# EAGLE design untitled (EAGLE 8.5.0)
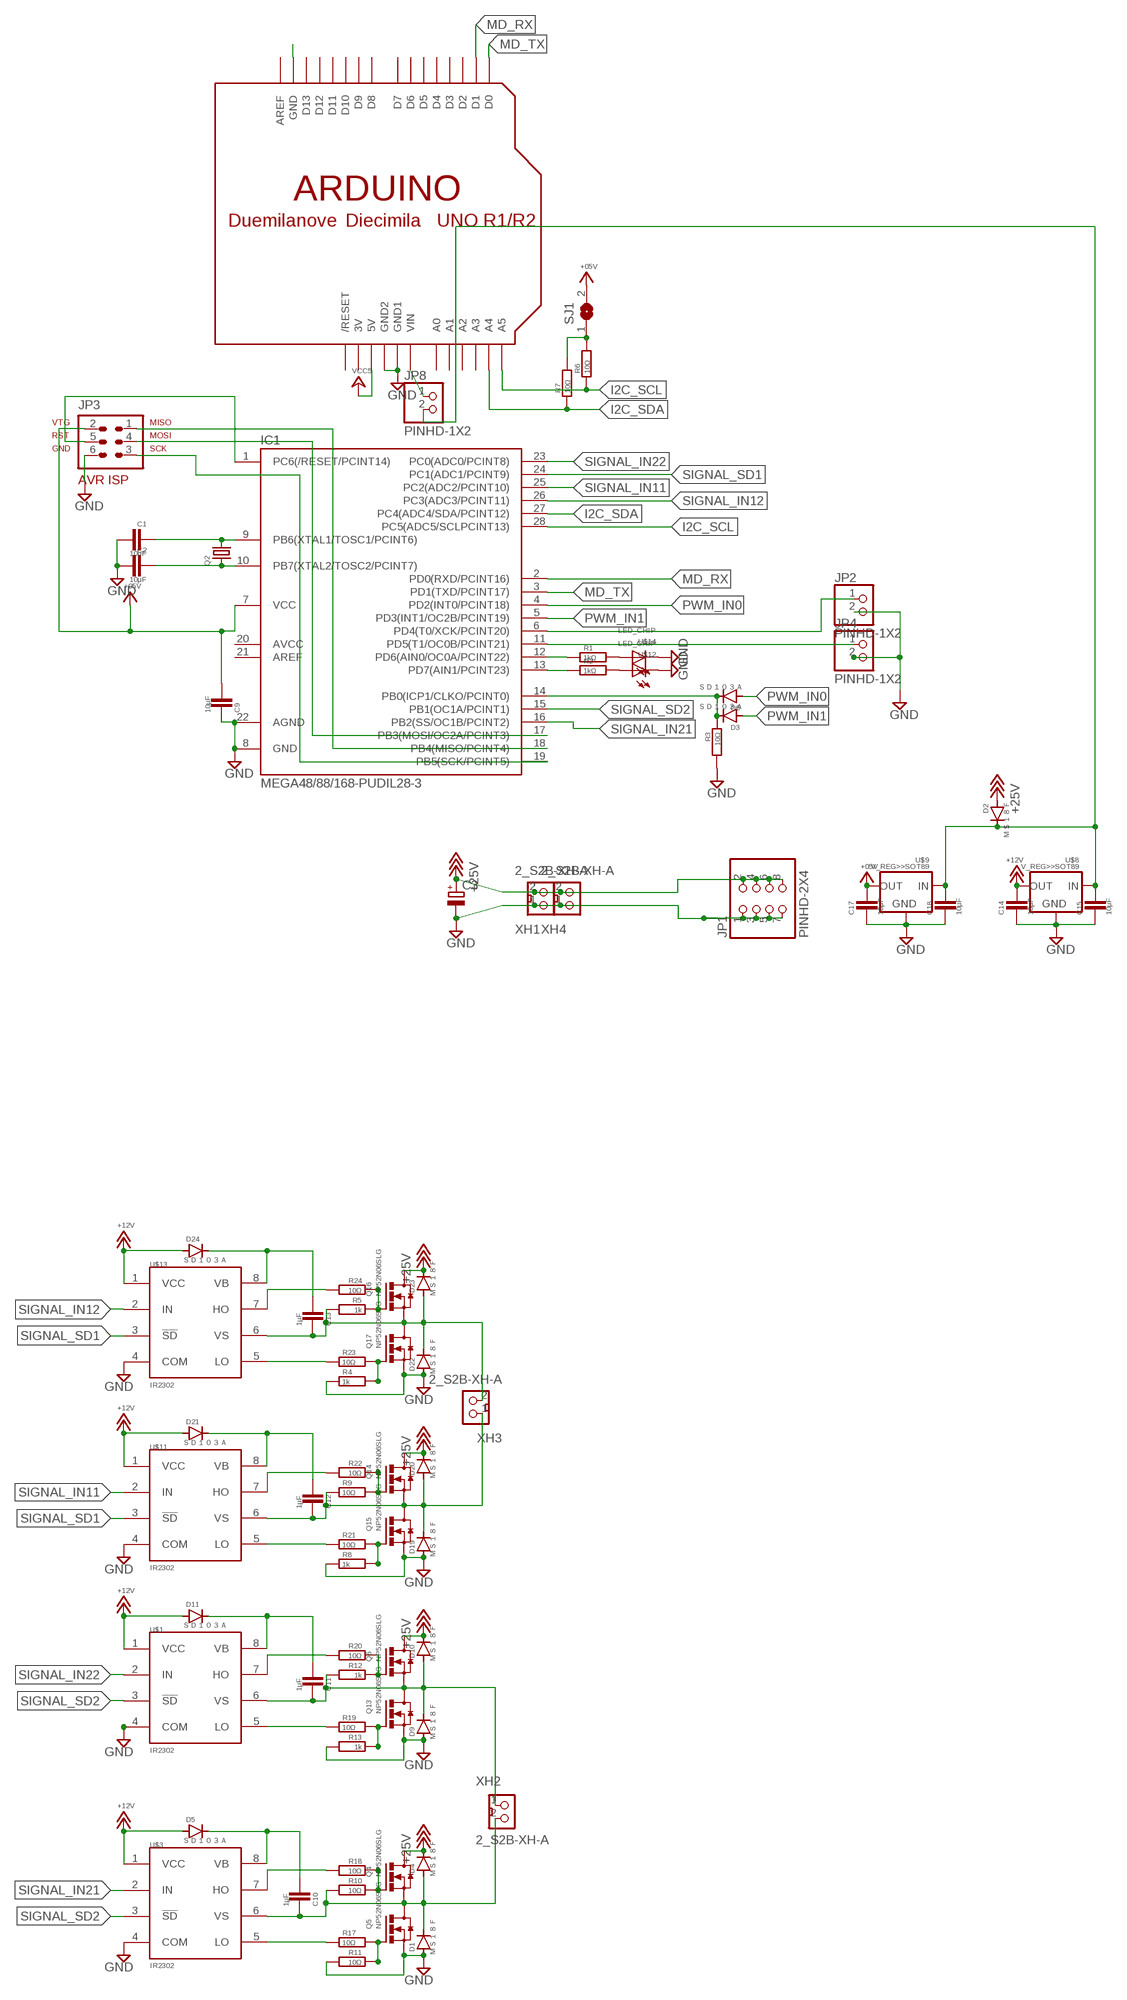
[diagram p0: schematic, sheet 1]

## Parts
C1  10μF  CAPACITOR>>2012  [2012]
C2  10μF  CAPACITOR>>2012  [2012]
C3  CPOL-EUUD-6,3X8,8  [UD-6,3X5,8_NICHICON]
C9  10μF  CAPACITOR>>2012  [2012]
C10  1μF  CAPACITOR>>2012  [2012]
C11  1μF  CAPACITOR>>2012  [2012]
C12  1μF  CAPACITOR>>2012  [2012]
C13  1μF  CAPACITOR>>2012  [2012]
C14  10μF  CAPACITOR>>2012  [2012]
C15  10μF  CAPACITOR>>2012  [2012]
C17  10μF  CAPACITOR>>2012  [2012]
C18  10μF  CAPACITOR>>2012  [2012]
D1  ＭＳ１８Ｆ  DIODE>>MS18F  [MS18F]
D2  ＭＳ１８Ｆ  DIODE>>MS18F  [MS18F]
D3  ＳＤ１０３Ａ  DIODE>>SOD123  [SOD123]
D4  ＭＳ１８Ｆ  DIODE>>MS18F  [MS18F]
D5  ＳＤ１０３Ａ  DIODE>>SOD123  [SOD123]
D6  ＳＤ１０３Ａ  DIODE>>SOD123  [SOD123]
D9  ＭＳ１８Ｆ  DIODE>>MS18F  [MS18F]
D10  ＭＳ１８Ｆ  DIODE>>MS18F  [MS18F]
D11  ＳＤ１０３Ａ  DIODE>>SOD123  [SOD123]
D19  ＭＳ１８Ｆ  DIODE>>MS18F  [MS18F]
D20  ＭＳ１８Ｆ  DIODE>>MS18F  [MS18F]
D21  ＳＤ１０３Ａ  DIODE>>SOD123  [SOD123]
D22  ＭＳ１８Ｆ  DIODE>>MS18F  [MS18F]
D23  ＭＳ１８Ｆ  DIODE>>MS18F  [MS18F]
D24  ＳＤ１０３Ａ  DIODE>>SOD123  [SOD123]
IC1  MEGA48/88/168-PUDIL28-3  [DIL28-3]
JP1  PINHD-2X4  [2X04]
JP2  PINHD-1X2  [1X02]
JP3  AVR-ISP-6  [AVR-ISP-6]
JP4  PINHD-1X2  [1X02]
JP8  PINHD-1X2  [1X02]
Q2  CRYSTALHC49UP  [HC49UP]
Q4  NP52N06SLG  MOSFET_N>>TO252  [TO252]
Q5  NP52N06SLG  MOSFET_N>>TO252  [TO252]
Q6  NP52N06SLG  MOSFET_N>>TO252  [TO252]
Q13  NP52N06SLG  MOSFET_N>>TO252  [TO252]
Q14  NP52N06SLG  MOSFET_N>>TO252  [TO252]
Q15  NP52N06SLG  MOSFET_N>>TO252  [TO252]
Q16  NP52N06SLG  MOSFET_N>>TO252  [TO252]
Q17  NP52N06SLG  MOSFET_N>>TO252  [TO252]
R1  1kΩ  REGISTER>>2012  [2012]
R2  1kΩ  REGISTER>>2012  [2012]
R3  10Ω  REGISTER>>2012  [2012]
R4  1k  REGISTER>>2012  [2012]
R5  1k  REGISTER>>2012  [2012]
R6  10Ω  REGISTER>>2012  [2012]
R7  10Ω  REGISTER>>2012  [2012]
R8  1k  REGISTER>>2012  [2012]
R9  10Ω  REGISTER>>2012  [2012]
R10  10Ω  REGISTER>>2012  [2012]
R11  10Ω  REGISTER>>2012  [2012]
R12  1k  REGISTER>>2012  [2012]
R13  1k  REGISTER>>2012  [2012]
R17  10Ω  REGISTER>>2012  [2012]
R18  10Ω  REGISTER>>2012  [2012]
R19  10Ω  REGISTER>>2012  [2012]
R20  10Ω  REGISTER>>2012  [2012]
R21  10Ω  REGISTER>>2012  [2012]
R22  10Ω  REGISTER>>2012  [2012]
R23  10Ω  REGISTER>>2012  [2012]
R24  10Ω  REGISTER>>2012  [2012]
SJ1  SJ  [SJ]
U$1  IR2302  IR2302IR2302  [DIL08]
U$2  ARDUINO-NOHOLE  [ARDUINO-NOHOLE]
U$3  IR2302  IR2302IR2302  [DIL08]
U$8  V_REG>>SOT89  [SOT89]
U$9  V_REG>>SOT89  [SOT89]
U$11  IR2302  IR2302IR2302  [DIL08]
U$12  LED_CHIP  [2012]
U$13  IR2302  IR2302IR2302  [DIL08]
U$14  LED_CHIP  [2012]
XH1  2_S2B-XH-A  [S2B-XH-A]
XH2  2_S2B-XH-A  [S2B-XH-A]
XH3  2_S2B-XH-A  [S2B-XH-A]
XH4  2_S2B-XH-A  [S2B-XH-A]

## Nets
+5V: C9.1 C17.1 IC1.7(VCC) JP3.2 SJ1.2 U$9.1(OUT) ; supply symbol labelled +05V
+12V: C14.1 D5.A D11.A D21.A D24.A U$1.1(VCC) U$3.1(VCC) U$8.1(OUT) U$11.1(VCC) U$13.1(VCC)
+18V: C3.+ D2.P$1(A) D4.P$2(C) D10.P$2(C) D20.P$2(C) D23.P$2(C) JP1.2 JP1.4 JP1.6 JP1.8 Q4.3(D) Q6.3(D) Q14.3(D) Q16.3(D) XH1.2 XH4.2 ; supply symbol labelled +25V
GND: C1.1 C2.1 C3.- C9.2 C14.2 C15.2 C17.2 C18.2 D1.P$1(A) D9.P$1(A) D19.P$1(A) D22.P$1(A) IC1.8(GND) IC1.22(AGND) JP1.1 JP1.3 JP1.5 JP1.7 JP2.2 JP3.6 JP4.2 Q5.2(S) Q13.2(S) Q15.2(S) Q17.2(S) R3.2 R4.1 R8.1 R11.2 R13.2 U$1.4(COM) U$2.GND1 U$2.GND2 U$3.4(COM) U$8.2(GND) U$8.2.1(GND) U$9.2(GND) U$9.2.1(GND) U$11.4(COM) U$12.P$2(C) U$13.4(COM) U$14.P$2(C) XH1.1 XH4.1
I2C_SCL: IC1.28(PC5(ADC5/SCLPCINT13)) R6.1 U$2.A5
I2C_SDA: IC1.27(PC4(ADC4/SDA/PCINT12)) R7.1 U$2.A4
MD_RX: IC1.2(PD0(RXD/PCINT16)) U$2.D1
MD_TX: IC1.3(PD1(TXD/PCINT17)) U$2.D0
N$1: C15.1 C18.1 D2.P$2(C) JP8.2 U$8.3(IN) U$9.3(IN)
N$2: JP8.1 U$2.VIN
N$3: C13.2 D22.P$2(C) D23.P$1(A) Q16.2(S) Q17.3(D) R5.2 U$13.6(VS) XH3.2
N$4: D3.C D6.C IC1.14(PB0(ICP1/CLKO/PCINT0)) R3.1
N$5: IC1.1(PC6(/RESET/PCINT14)) JP3.5
N$6: IC1.12(PD6(AIN0/OC0A/PCINT22)) R1.1
N$7: C1.2 IC1.9(PB6(XTAL1/TOSC1/PCINT6)) Q2.2
N$8: C2.2 IC1.10(PB7(XTAL2/TOSC2/PCINT7)) Q2.1
N$9: IC1.11(PD5(T1/OC0B/PCINT21)) JP4.1
N$10: IC1.13(PD7(AIN1/PCINT23)) R2.1
N$11: IC1.19(PB5(SCK/PCINT5)) JP3.3
N$12: C11.2 D9.P$2(C) D10.P$1(A) Q6.2(S) Q13.3(D) R12.2 U$1.6(VS) XH2.1
N$14: IC1.6(PD4(T0/XCK/PCINT20)) JP2.1
N$15: R1.2 U$14.P$1(A)
N$16: R2.2 U$12.P$1(A)
N$17: C10.2 D1.P$2(C) D4.P$1(A) Q4.2(S) Q5.3(D) R10.2 U$3.6(VS) XH2.2
N$18: Q5.1(G) R11.1 R17.2
N$19: R17.1 U$3.5(LO)
N$20: R6.2 R7.2 SJ1.1
N$21: IC1.17(PB3(MOSI/OC2A/PCINT3)) JP3.4
N$22: IC1.18(PB4(MISO/PCINT4)) JP3.1
N$23: R18.2 U$3.7(HO)
N$24: C10.1 D5.C U$3.8(VB)
N$25: Q4.1(G) R10.1 R18.1
N$27: U$2.GND
N$32: Q13.1(G) R13.1 R19.2
N$34: R19.1 U$1.5(LO)
N$42: R20.2 U$1.7(HO)
N$45: C11.1 D11.C U$1.8(VB)
N$46: Q6.1(G) R12.1 R20.1
N$48: C12.2 D19.P$2(C) D20.P$1(A) Q14.2(S) Q15.3(D) R9.1 U$11.6(VS) XH3.1
N$50: Q15.1(G) R8.2 R21.2
N$51: R21.1 U$11.5(LO)
N$52: R22.2 U$11.7(HO)
N$53: C12.1 D21.C U$11.8(VB)
N$54: Q14.1(G) R9.2 R22.1
N$56: Q17.1(G) R4.2 R23.2
N$57: R23.1 U$13.5(LO)
N$58: R24.2 U$13.7(HO)
N$59: C13.1 D24.C U$13.8(VB)
N$60: Q16.1(G) R5.1 R24.1
PWM_IN0: D6.A IC1.4(PD2(INT0/PCINT18))
PWM_IN1: D3.A IC1.5(PD3(INT1/OC2B/PCINT19))
SIGNAL_IN11: IC1.25(PC2(ADC2/PCINT10)) U$11.2(IN)
SIGNAL_IN12: IC1.26(PC3(ADC3/PCINT11)) U$13.2(IN)
SIGNAL_IN21: IC1.16(PB2(SS/OC1B/PCINT2)) U$3.2(IN)
SIGNAL_IN22: IC1.23(PC0(ADC0/PCINT8)) U$1.2(IN)
SIGNAL_SD1: IC1.24(PC1(ADC1/PCINT9)) U$11.3(!SD) U$13.3(!SD)
SIGNAL_SD2: IC1.15(PB1(OC1A/PCINT1)) U$1.3(!SD) U$3.3(!SD)
VCC5: U$2.5V
Unconnected: IC1.20(AVCC) IC1.21(AREF) U$2.A0 U$2.A1 U$2.A2 U$2.A3 U$2.AREF U$2.D2 U$2.D3 U$2.D4 U$2.D5 U$2.D6 U$2.D7 U$2.D8 U$2.D9 U$2.D10 U$2.D11 U$2.D12 U$2.D13 U$2.RESET(/RESET)

## Power pins joined to a net without a drawn wire
3V: U$2.3V

## Library data of the parts
C1 C2 C9-C15 C17 C18 = !SMD:CAPACITOR>>
C3 = !rcl:CPOL-EU: POLARIZED CAPACITOR, European symbol
D1-D6 D9-D11 D19-D24 = !diode:DIODE>>: DIODE
IC1 = !avr:MEGA48/88/168-PU
JP1 = !pinhead(ﾋﾟﾝﾍｯﾀﾞ):PINHD-2X4: PIN HEADER
JP2 JP4 JP8 = !pinhead(ﾋﾟﾝﾍｯﾀﾞ):PINHD-1X2: PIN HEADER
JP3 = !avr:AVR-ISP-6: AVR ISP-6 Serial Programming Header
Q2 = !crystal(水晶):CRYSTAL: CRYSTAL; OC_FARNELL: unknown; OC_NEWARK: unknown
Q4-Q6 Q13-Q17 = !FET_transister_v-reg:MOSFET_N>>
R1-R13 R17-R24 = !SMD:REGISTER>>
SJ1 = jumper:SJ: SMD solder JUMPER
U$1 U$3 U$11 U$13 = !irs(GateDriver):IR2302
U$2 = adafruit:ARDUINO: Arduino Diecimila/Duemilanove Make a shield with ease, this package has all the named pins as well as the two mounting drill holes and an outline of the USB and DC power connector. The outline is on the DIMENSION layer, so if your board house uses it they will cut the outline to match. http://www.ladyada.net/library/pcb/eaglelibrary.html
U$8 U$9 = !FET_transister_v-reg:V_REG>>
U$12 U$14 = !led:LED_CHIP
XH1-XH4 = !con-xh:2_: Wire-to-Board 2.5mm pitch top mount connector Source: http://www.jst-mfg.com/product/pdf/jpn/XH.pdf http://www.jst-mfg.com/product/detail.php?series=277

## Board
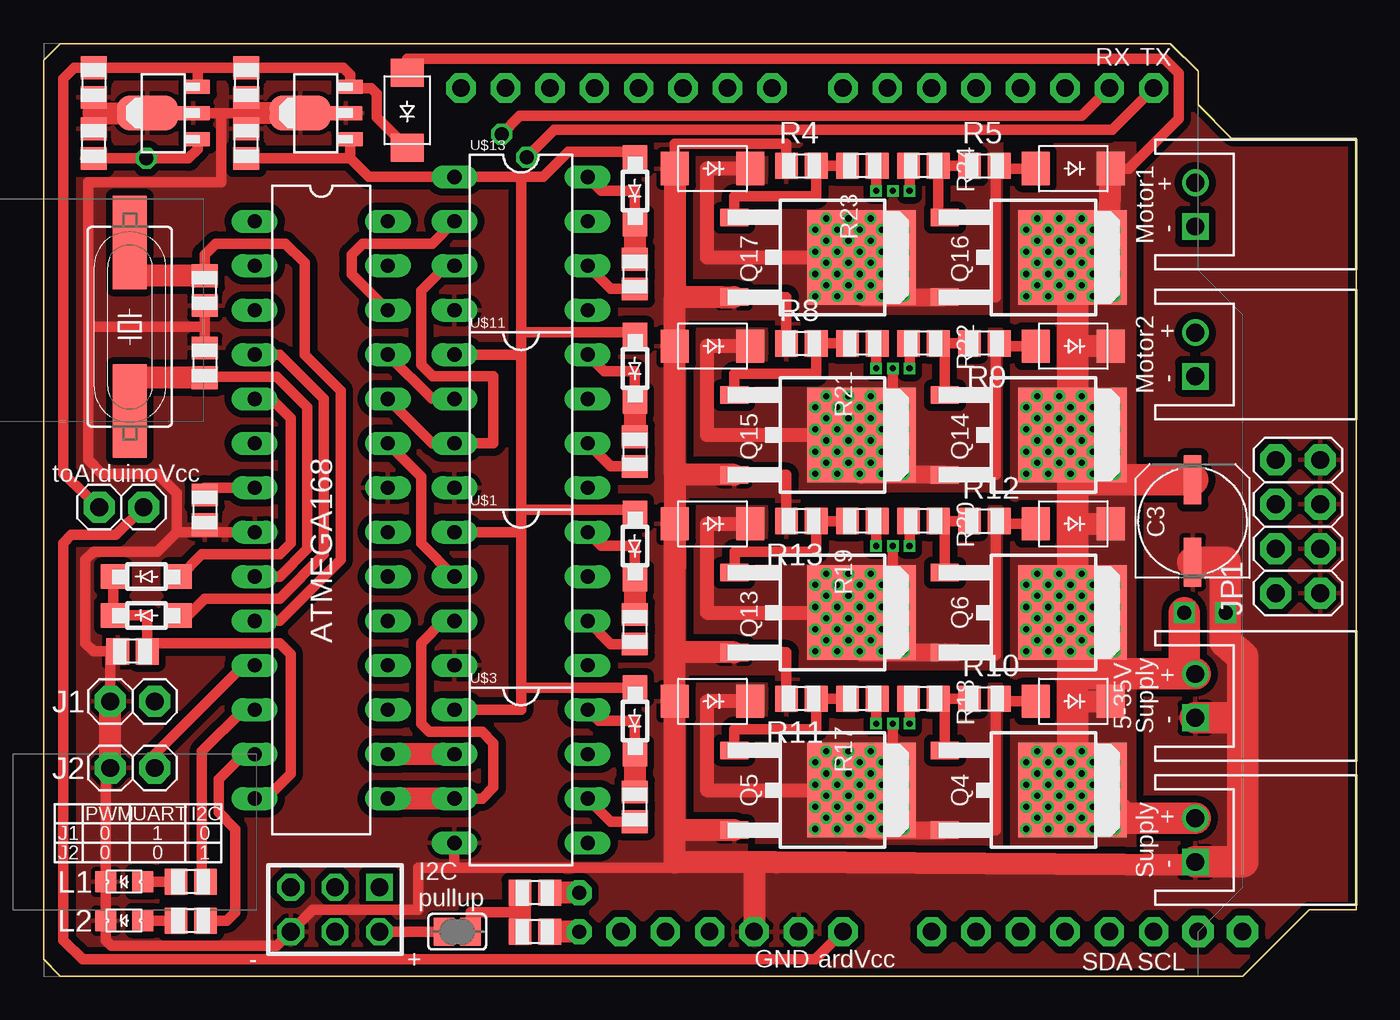
[diagram p1: board, top side]
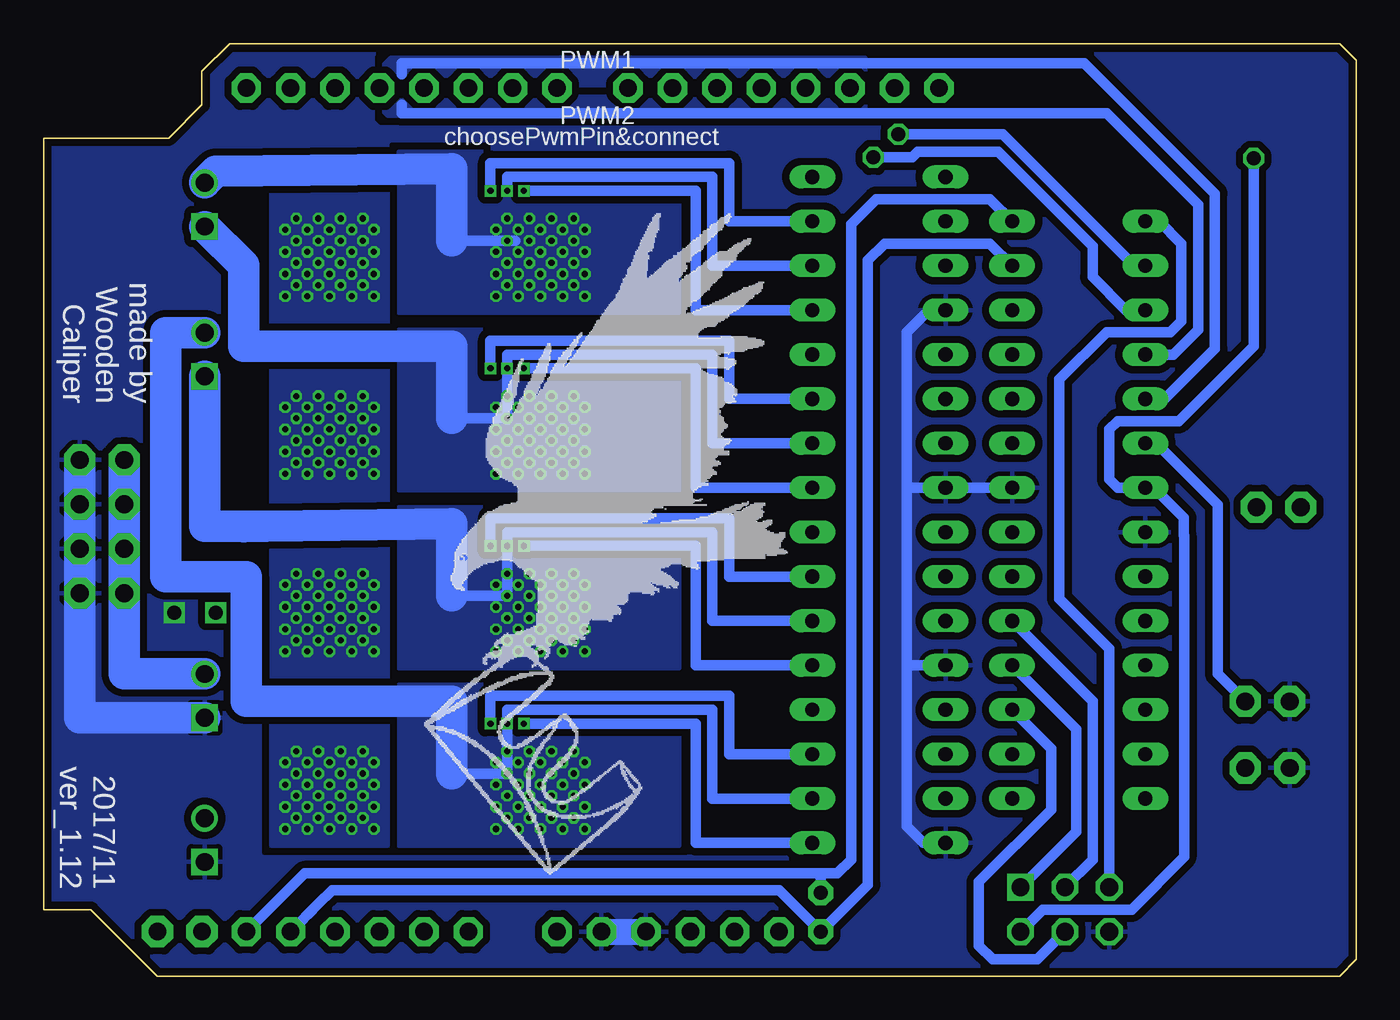
[diagram p2: board, bottom side, seen from below]

Size 75.09 x 53.34 mm. Coordinates in mm from the lower left corner, seen from the top.
Outline: 0.95,53.34 0,52.39 0,0.95 0.95,0 68.58,0 72.39,3.81 75.09,3.81 75.09,47.94 67.94,47.94 66.04,49.85 66.04,51.75 64.45,53.34 0.95,53.34
Copper layers (1*16): Top 0.035mm / dielectric 1.5mm / Bottom 0.035mm
Design rules "SeeedStudio_2layer_DRU_no_angle_20140221": minimum track width 6mil, minimum drill 12mil, track to track 6mil, track to pad 6mil, pad to pad 6mil, via to via 6mil, smd to smd 0mil, copper to edge 10mil, drill to drill 10mil, minimum pad ring 10mil, minimum via ring 6mil, stop-mask expansion 2mil, vias tented up to drill 100mil, thermal gap 10mil

### Footprints (pad centres in the part's own frame; a part is rotated, then mirrored left to right if it is on the bottom)
2012 = smd 1.3 x 1.5: 1 -0.85,0; 2 0.85,0
UD-6,3X5,8_NICHICON = smd 2.8 x 1: + 2.35,0; - -2.35,0
MS18F = smd 1.6 x 1.9: P$1 -2.15,0; P$2 2.15,0
SOD123 = smd 1.4 x 1.4: A 1.9,0; C -1.9,0
DIL28-3 = drill 0.813 long: 1 -16.51,-3.81; 2 -13.97,-3.81; 3 -11.43,-3.81; 4 -8.89,-3.81; 5 -6.35,-3.81; 6 -3.81,-3.81; 7 -1.27,-3.81; 8 1.27,-3.81; 9 3.81,-3.81; 10 6.35,-3.81; 11 8.89,-3.81; 12 11.43,-3.81; 13 13.97,-3.81; 14 16.51,-3.81; 15 16.51,3.81; 16 13.97,3.81; 17 11.43,3.81; 18 8.89,3.81; 19 6.35,3.81; 20 3.81,3.81; 21 1.27,3.81; 22 -1.27,3.81; 23 -3.81,3.81; 24 -6.35,3.81; 25 -8.89,3.81; 26 -11.43,3.81; 27 -13.97,3.81; 28 -16.51,3.81
2X04 = drill 1.016 pad 1.778 octagon: 1 -3.81,-1.27; 2 -3.81,1.27; 3 -1.27,-1.27; 4 -1.27,1.27; 5 1.27,-1.27; 6 1.27,1.27; 7 3.81,-1.27; 8 3.81,1.27
1X02 = drill 1.016 pad 1.778 octagon: 1 -1.27,0; 2 1.27,0
AVR-ISP-6 = drill 1.016 square: 1 -2.54,-1.27 | drill 1.016 octagon: 2 -2.54,1.27; 3 0,-1.27; 4 0,1.27; 5 2.54,-1.27; 6 2.54,1.27
HC49UP = smd 5.334 x 1.93: 1 -4.826,0; 2 4.826,0
TO252 = smd 1 x 1.6: 1 -2.28,-4.8; 2 2.28,-4.8 | smd 5.4 x 6.2: 3 0,2.5
SJ = smd 1.168 x 1.6: 1 -0.762,0; 2 0.762,0
DIL08 = drill 0.813 long: 1 -3.81,-3.81; 2 -1.27,-3.81; 3 1.27,-3.81; 4 3.81,-3.81; 5 3.81,3.81; 6 1.27,3.81; 7 -1.27,3.81; 8 -3.81,3.81
ARDUINO-NOHOLE = drill 1 pad 1.676 octagon: 3V 35.56,2.54; 5V 38.1,2.54; A0 50.8,2.54; A1 53.34,2.54; A2 55.88,2.54; A3 58.42,2.54; A4 60.96,2.54; A5 63.5,2.54; AREF 23.876,50.8; D0 63.5,50.8; D1 60.96,50.8; D2 58.42,50.8; D3 55.88,50.8; D4 53.34,50.8; D5 50.8,50.8; D6 48.26,50.8; D7 45.72,50.8; D8 41.656,50.8; D9 39.116,50.8; D10 36.576,50.8; D11 34.036,50.8; D12 31.496,50.8; D13 28.956,50.8; GND 26.416,50.8; GND1 43.18,2.54; GND2 40.64,2.54; RESET 33.02,2.54; VIN 45.72,2.54
SOT89 = smd 0.8 x 1.4: 1 -1.499,-1.981; 3 1.499,-1.981 | smd 0.8 x 1.9: 2 0,-1.727 | smd 2 x 3.5: 2.1 0,0.889
2012' = smd 1.2 x 1.2: P$1 -1.05,0; P$2 1.05,0
S2B-XH-A = drill 1.016 square: 1 1.25,0 | drill 1.016: 2 -1.25,0

### Placement (x,y rotation side)
C1  9.21,35.08 270 top
C2  9.21,39.21 90 top
C3  65.72,26.04 90 top
C9  9.21,26.67 270 top
C10  33.81,9.68 270 top
C11  33.81,19.84 270 top
C12  33.81,30 270 top
C13  33.81,40.16 270 top
C14  11.59,47.62 90 top
C15  2.86,51.12 270 top
C17  2.86,47.62 90 top
C18  11.59,51.12 270 top
D1  38.26,15.72 0 top
D2  20.8,49.53 270 top
D3  5.87,22.86 0 top
D4  58.9,15.72 0 top
D5  33.81,14.61 90 top
D6  5.87,20.64 0 top
D9  38.26,25.88 0 top
D10  58.9,25.88 0 top
D11  33.81,24.61 90 top
D19  38.26,36.04 0 top
D20  58.9,36.04 0 top
D21  33.81,34.77 90 top
D22  38.26,46.2 0 top
D23  58.9,46.2 0 top
D24  33.81,44.93 90 top
IC1  15.88,26.67 270 top
JP1  71.75,25.72 90 top
JP2  5.08,15.72 180 top
JP3  16.67,3.81 180 top
JP4  5.08,11.91 180 top
JP8  4.45,26.83 180 top
Q2  4.92,37.15 270 top
Q4  56.36,10.64 270 top
Q5  44.29,10.64 270 top
Q6  56.36,20.8 270 top
Q13  44.29,20.8 270 top
Q14  56.36,30.96 270 top
Q15  44.29,30.96 270 top
Q16  56.36,41.12 270 top
Q17  44.29,41.12 270 top
R1  8.41,5.4 180 top
R2  8.41,3.17 180 top
R3  5.08,18.57 180 top
R4  43.34,46.35 0 top
R5  53.82,46.35 0 top
R6  28.1,4.76 180 top
R7  28.1,2.54 180 top
R8  43.34,36.2 0 top
R9  53.82,36.2 180 top
R10  53.82,15.88 0 top
R11  43.34,15.88 180 top
R12  53.82,26.04 0 top
R13  43.34,26.04 180 top
R17  46.83,15.88 180 top
R18  50.32,15.88 180 top
R19  46.83,26.04 180 top
R20  50.32,26.04 180 top
R21  46.83,36.2 180 top
R22  50.32,36.2 180 top
R23  46.83,46.35 180 top
R24  50.32,46.35 180 top
SJ1  23.65,2.54 180 top
U$1  27.3,21.59 270 top
U$2  0,0 0 top
U$3  27.3,11.43 270 top
U$8  15.56,49.37 90 top
U$9  6.83,49.37 90 top
U$11  27.3,31.75 270 top
U$12  LED_CHIP  [2012']  4.6,3.17 180 top
U$13  27.3,41.91 270 top
U$14  LED_CHIP  [2012']  4.6,5.4 180 top
XH1  65.88,16.03 270 top
XH2  65.88,35.56 270 top
XH3  65.88,44.13 270 top
XH4  65.88,7.78 270 top

### Tracks (layer width: path | path; a pad name or v marks a point on that pad's centre or on a via)
+5V  (via drill 0.8)
  Top 0.61: 2.38,46.77 C17.1 v5.87,46.77 8.28,46.77 8.81,47.31 U$9.1 | C9.1 9.21,27.94 IC1.7 | JP3.2 SJ1.2
  Bottom 0.61: JP3.2 17.94,3.81 12.86,3.81 9.84,6.83 9.84,25.2 9.86,25.22 9.86,26.21 11.59,27.94 IC1.7 13.65,27.94 14.13,28.42 14.13,31.27 13.65,31.75 10.16,31.75 5.87,36.04 v5.87,46.77
+12V
  Top 0.61: D24.A 33.81,47.15 30,47.15 28.57,45.72 27.3,45.72 | 27.3,35.56 27.3,36.83 | D5.A 27.3,16.51 | D11.A 33.81,26.67 27.3,26.67 | D21.A 33.81,36.83 27.3,36.83 | 27.3,25.4 27.3,26.67 | 26.67,15.24 U$3.1 27.3,15.24 27.3,16.51 | 27.3,36.83 27.3,45.72 | 27.3,35.56 U$11.1 | U$1.1 27.3,25.4 | 27.3,26.67 27.3,35.56 | 27.3,16.51 27.3,25.4 | U$8.1 17.54,46.77 | 17.54,46.77 C14.1 | 27.3,45.72 U$13.1 18.59,45.72 17.54,46.77
+18V  (via drill 0.35, 0.8)
  Top 0.61: 58.9,20.8 Q6.3 58.86,18.57 | Q4.3 58.9,10.64 | 58.9,30.96 Q14.3 58.86,28.73 | 57.63,41.12 Q16.3 56.2,41.12 | Q4.3 58.86,9.03 | D23.P$2 62.07,46.2 64.93,49.05 64.93,51.64 64.09,52.48 20.8,52.48 D2.P$1 | Q4.3 58.86,8.41
  Top 1.016: Q4.3 58.88,9.19 61.44,9.19
  Top 1.27: 59.49,41.41 Q16.3 60.17,41.12 60.92,41.12 D23.P$2 | 59.53,10.64 58.86,10.71 | 58.86,14.45 58.86,15.72 D4.P$2 | D20.P$2 58.86,36.04 | 58.86,25.88 D10.P$2
  Top 1.8: Q4.3 58.86,10.71 58.86,14.45 58.86,17.28 | 58.86,17.28 Q6.3 58.86,25.88 58.86,28.39 | 58.86,28.39 Q14.3 58.86,36.04 Q16.3 | XH4.2 61.44,9.03 61.44,9.19 61.44,9.37 | C3.+ 58.86,28.39 | 65.25,17.28 v65.25,20.8 | XH1.2 65.25,17.28 | 65.25,17.28 58.86,17.28
  Bottom 1.8: JP1.8 JP1.6 JP1.4 JP1.2 70.48,17.28 XH1.2
  other vias: 56.2,38.89 56.83,39.53 56.2,40.16 56.83,40.8 56.2,41.43 56.83,42.07 56.2,42.7 56.83,43.34 57.47,42.7 57.47,41.43 57.47,40.16 57.47,38.89 58.1,39.53 58.1,40.8 58.1,42.07 58.1,43.34 58.74,42.7 59.37,43.34 60.01,42.7 59.37,42.07 58.74,41.43 59.37,40.8 58.74,40.16 59.37,39.53 58.74,38.89 60.01,41.43 60.01,40.16 60.01,38.89 60.64,39.53 61.28,38.89 61.28,40.16 60.64,40.8 61.28,41.43 60.64,42.07 61.28,42.7 60.64,43.34 56.2,28.73 56.83,29.37 56.2,30 56.83,30.64 56.2,31.27 56.83,31.91 56.2,32.54 56.83,33.18 57.47,32.54 58.1,33.18 58.1,31.91 57.47,31.27 58.1,30.64 57.47,30 58.1,29.37 57.47,28.73 58.74,28.73 58.74,30 59.37,29.37 60.01,28.73 60.64,29.37 60.01,30 59.37,30.64 58.74,31.27 59.37,31.91 58.74,32.54 59.37,33.18 60.01,32.54 60.64,33.18 61.28,32.54 60.64,31.91 60.01,31.27 61.28,31.27 60.64,30.64 61.28,30 61.28,28.73 56.2,18.57 56.83,19.21 57.47,18.57 57.47,19.84 56.2,19.84 56.83,20.48 57.47,21.11 56.2,21.11 56.83,21.75 56.2,22.38 57.47,22.38 56.83,23.02 58.1,23.02 58.74,22.38 58.1,21.75 58.1,20.48 58.74,21.11 58.1,19.21 58.74,18.57 58.74,19.84 59.37,19.21 60.01,18.57 60.64,19.21 61.28,18.57 61.28,19.84 60.01,19.84 59.37,20.48 60.64,20.48 61.28,21.11 60.01,21.11 59.37,21.75 60.64,21.75 61.28,22.38 60.01,22.38 59.37,23.02 60.64,23.02 56.2,8.41 56.83,9.05 57.47,9.68 57.47,8.41 58.1,9.05 56.2,9.68 56.83,10.32 56.2,10.95 56.83,11.59 57.47,10.95 58.1,10.32 58.74,9.68 59.37,9.05 58.74,8.41 60.01,8.41 60.01,9.68 59.37,10.32 58.74,10.95 58.1,11.59 56.2,12.22 56.83,12.86 57.47,12.22 58.1,12.86 58.74,12.22 59.37,12.86 59.37,11.59 60.01,12.22 60.64,12.86 61.28,12.22 60.64,11.59 61.28,10.95 60.01,10.95 60.64,10.32 61.28,9.68 60.64,9.05 61.28,8.41
  pour Top (isolate 0.406, rank 2, no thermals): 62.39,7.46 62.39,47.62 55.4,47.62 55.4,7.46
  pour Bottom (isolate 0.406, rank 2, no thermals): 62.07,7.46 62.07,47.62 55.4,47.62 55.4,7.46
GND  (via drill 0.8)
  Top 0.61: 13.89,49.69 13.89,49.37 U$8.2.1 U$8.2 | 23.18,27.94 U$11.4 | 10.16,49.37 U$9.2 | 11.59,49.37 10.16,49.37 | 10.16,49.37 10.16,45.4 2.54,45.4 2.54,37.15 | 2.54,37.15 9.21,37.15 | 7.62,25.4 9.21,25.4 | 36.11,8.36 36.11,6.19 23.5,6.19 | IC1.8 9.21,25.4 | C9.2 9.21,25.4 | JP4.2 3.55,11.17 U$14.P$2 U$12.P$2 3.55,2.06 3.87,1.75 13.34,1.75 JP3.6 15.4,3.81 21.43,3.81 21.43,6.19 23.5,6.19 | C2.1 9.21,37.15 | C1.1 9.21,37.15 | 7.62,25.4 6.51,24.29 2.86,24.29 2.38,23.81 2.38,19.05 2.86,18.57 3.81,18.57 | 3.81,18.57 R3.2 | JP2.2 3.81,18.57 | R4.1 42.49,47.62 36.11,47.62 D22.P$1 | R8.1 42.49,38.84 38.73,38.84 | R13.2 42.49,28.68 Q15.2 | R11.2 42.49,18.52 Q13.2 | 2.54,37.15 2.54,29.53 3.33,28.73 6.51,28.73 7.62,27.62 7.62,25.4 | U$3.4 23.5,6.19
  Top 0.813: 6.62,49.37 U$9.2
  Top 1.27: 2.86,49.37 C17.2 | C15.2 2.86,49.37 | 2.86,49.37 U$9.2.1 6.62,49.37 | 36.11,38.84 D19.P$1 36.11,28.68 | D22.P$1 36.11,38.84 | 36.11,28.68 D9.P$1 | D9.P$1 36.11,23.42 | Q17.2 38.73,38.84 36.11,38.84 | Q15.2 36.11,28.68 | Q13.2 36.11,18.52 | 36.11,18.52 D9.P$1 | Q5.2 36.11,8.36 | 36.11,8.36 D1.P$1 36.11,18.52 | XH4.1 65.88,6.35 41.91,6.5 | 41.91,6.5 40.64,6.51 U$2.GND2 | C14.2 11.59,49.37 | U$8.2.1 11.59,49.37 | 11.59,49.37 C18.2 | JP4.2 JP2.2 | 41.91,6.5 36.11,6.5 36.11,8.36
  Top 1.8: 68.58,14.78 XH1.1 | 68.58,14.78 68.58,18.26 67.59,19.13 67.59,20.8 | 68.58,14.78 68.58,6.53 XH4.1 | C3.- 67.59,23.68 67.59,20.8 | v67.63,20.8 67.59,20.8
  Bottom 0.61: 25.72,27.94 U$11.4 IC1.22 | 25.72,17.78 25.72,27.94 | 25.72,27.94 25.72,36.83 24.45,38.1 U$13.4 | U$1.4 25.72,17.78 | 25.72,17.78 25.72,8.57 24.77,7.62 U$3.4
  Bottom 1.5: U$2.GND1 U$2.GND2
  Bottom 1.8: JP1.7 JP1.5 JP1.3 JP1.1 73.03,14.78 XH1.1
  pour Bottom (isolate 0.406, rank 6): 0,53.34 64.45,53.34 66.04,51.75 66.04,49.69 67.79,47.94 75.09,47.94 75.09,3.81 72.39,3.81 68.58,0 0,0
  pour Top (isolate 0.406, rank 6): 0,53.34 64.45,53.34 66.04,51.75 66.04,49.69 67.79,47.94 75.09,47.94 75.09,3.81 72.39,3.81 68.58,0 0,0
I2C_SCL  (via drill 0.8 pad 1.42)
  Top 1.27: v30.64,4.76 R6.1
  Bottom 0.61: IC1.28 20.95,44.45 27.46,44.45 28.89,43.02 28.89,6.67 29.69,5.87 30.64,5.87 | U$2.A5 60.17,5.87 30.64,5.87 | 30.64,5.87 v30.64,4.76
I2C_SDA  (via drill 0.8 pad 1.42)
  Top 1.27: v30.64,2.54 R7.1
  Bottom 0.61: 19.05,40.64 IC1.27 20.95,41.91 26.99,41.91 27.94,40.96 27.94,5.24 v30.64,2.54 33.02,4.92 58.58,4.92 59.37,4.13 | 59.37,4.13 59.93,3.57 | 59.37,4.13 U$2.A4
MD_RX  (via drill 0.8)
  Top 0.61: U$2.D1 59.37,49.21 27.24,49.21 v26.19,48.17
  Bottom 0.61: IC1.2 12.7,40.64 20.23,48.17 v26.19,48.17
MD_TX  (via drill 0.8)
  Top 0.61: U$2.D0 61.12,48.42 29.21,48.42 v27.62,46.83
  Bottom 0.61: v27.62,46.83 25.4,46.83 25.08,47.15 20.48,47.15 15.08,41.75 15.08,40.01 13.18,38.1 IC1.3
N$1
  Top 0.61: 17.54,50.96 U$8.3 | 8.81,51.97 C18.1 17.14,51.97 17.54,51.57 17.54,50.96 | U$9.3 8.81,51.97 | 8.81,51.97 C15.1 1.75,51.97 1.11,51.33 1.11,28.73 JP8.2 | 17.54,50.96 17.7,50.8 18.73,50.8 19.05,50.48 19.05,49.13 D2.P$2
N$2
  Top 0.61: U$2.VIN 44.13,0.95 2.22,0.95 1.11,2.06 1.11,24.77 1.59,25.24 4.13,25.24 JP8.1
N$3  (via drill 0.35)
  Top 0.61: Q17.3 48.1,41.12 | U$13.6 32.44,39.31 C13.2 | 45.09,41.12 44.13,41.12 | D23.P$1 54.83,46.2 R5.2 54.45,46.35 54.45,38.84 Q16.2
  Top 0.813: D22.P$2 37.94,46.2 37.94,41.12 45.09,41.12 Q17.3
  Top 1.016: Q17.3 46.79,38.84 Q16.2 51.59,38.84
  Bottom 0.61: U$13.6 36.83,40.64 36.83,45.72 48.58,45.72 v48.58,44.93 | 48.1,42.07 51.75,42.07
  Bottom 1.8: XH3.2 65.88,45.4 65.25,46.04 51.75,46.2 51.75,42.07
  other vias: 44.77,42.07 45.4,41.43 45.4,42.7 44.13,42.7 44.13,41.43 46.04,40.8 46.04,42.07 46.67,41.43 46.67,42.7 44.77,43.34 46.67,40.16 44.77,40.8 44.13,40.16 44.13,38.89 45.4,40.16 44.77,39.53 45.4,38.89 46.04,39.53 46.67,38.89 46.04,43.34 47.31,43.34 47.31,42.07 47.31,40.8 47.31,39.53 47.94,38.89 47.94,40.16 47.94,41.43 47.94,42.7 48.58,42.07 48.58,43.34 49.21,42.7 49.21,41.43 48.58,40.8 49.21,40.16 48.58,39.53 49.21,38.89
  pour Top (isolate 0.406, rank 3, no thermals): 54.77,48.26 36.35,48.26 37.31,37.94 54.77,37.94
  pour Bottom (isolate 0.406, rank 3, no thermals): 38.73,47.15 54.77,47.15 54.77,37.94 38.73,37.94
N$4
  Top 0.61: D3.C D6.C 5.93,20.64 5.93,19.05 | 5.93,19.05 R3.1 | 5.93,19.05 13.49,19.05 14.13,18.41 14.13,11.59 12.7,10.16 IC1.14
N$5
  Bottom 0.61: JP3.5 14.13,18.73 16.99,21.59 16.99,34.13 14.29,36.83 10.64,36.83 10,37.47 10,41.91 11.27,43.18 IC1.1
N$6
  Top 0.61: IC1.12 11.43,15.24 9.05,12.86 9.05,5.61 R1.1
N$7
  Top 0.61: IC1.9 13.49,22.86 15.08,24.45 15.08,32.54 13.34,34.29 7.46,34.29 C1.2
  Top 1.27: C1.2 4.92,34.23 Q2.2
N$8
  Top 0.61: C2.2 9.21,41.27 9.84,41.91 13.81,41.91 14.92,40.8 14.92,35.56 16.99,33.5 16.99,23.81 13.49,20.32 IC1.10
  Top 1.27: C2.2 5.08,40.06 Q2.1
N$9
  Top 0.61: IC1.11 11.43,17.78 6.35,12.7 JP4.1
N$10
  Top 0.61: R2.1 10.48,3.17 10.95,3.65 10.95,8.41 10,9.37 10,11.27 11.43,12.7 IC1.13
N$11
  Bottom 0.61: JP3.3 15.08,6.67 15.08,15.72 IC1.19
N$12  (via drill 0.35)
  Top 0.61: Q13.3 48.1,20.8 48.36,22.87 48.58,22.87 v48.58,24.61 | U$1.6 32.44,18.99 C11.2 | 54.67,25.88 D10.P$1 | R12.2 54.67,25.88 | Q6.2 54.45,18.36 54.45,25.72 54.67,25.88
  Top 0.813: D9.P$2 37.94,25.88 37.94,20.8 Q13.3
  Top 1.016: Q13.3 46.79,18.52 Q6.2 51.59,18.52
  Bottom 0.61: U$1.6 36.83,20.32 36.83,25.4 48.58,25.4 v48.58,24.61 v48.58,21.75 51.75,21.75
  Bottom 1.8: 62.39,25.74 51.75,25.88 51.75,21.75 | 62.39,25.74 63.66,25.72 | XH2.1 65.88,25.74 62.39,25.74
  other vias: 44.13,18.57 44.77,19.21 45.4,18.57 44.13,19.84 45.4,19.84 44.77,20.48 44.13,21.11 45.4,21.11 44.77,21.75 44.13,22.38 45.4,22.38 44.77,23.02 46.04,23.02 46.67,22.38 46.04,21.75 46.67,21.11 46.04,20.48 46.67,19.84 47.31,20.48 47.31,21.75 47.31,23.02 47.94,22.38 48.58,23.02 49.21,22.38 47.94,21.11 48.58,20.48 49.21,21.11 49.21,19.84 47.94,19.84 47.31,19.21 48.58,19.21 49.21,18.57 47.94,18.57 46.04,19.21 46.67,18.57
  pour Bottom (isolate 0.406, rank 3, no thermals): 54.77,26.83 54.77,17.62 38.73,17.62 38.73,26.83
  pour Top (isolate 0.406, rank 3, no thermals): 37.31,26.83 37.31,17.62 54.77,17.62 54.77,26.83
N$14
  Bottom 0.61: IC1.6 11.43,30.48 7.93,26.98 7.93,17.29 JP2.1
N$15
  Top 0.61: U$14.P$1 R1.2
N$16
  Top 0.61: U$12.P$1 R2.2
N$17  (via drill 0.35)
  Top 0.61: 48.74,11.59 46.83,11.59 | U$3.6 32.44,8.83 C10.2 | 48.1,10.64 Q5.3 46.79,8.41 | v48.58,14.45 v48.58,12.86 | 54.67,15.72 D4.P$1 | R10.2 54.67,15.72 | Q4.2 54.45,8.36 54.45,15.72 54.67,15.72
  Top 0.813: Q5.3 37.94,10.64 37.94,15.72 D1.P$2
  Top 1.016: 51.59,8.36 Q4.2 47.31,8.36 47.31,10.64 48.42,10.64
  Top 1.27: 47.31,10.64 Q5.3
  Top 1.8: 48.42,10.64 Q5.3
  Bottom 0.61: U$3.6 36.83,10.16 36.83,15.24 48.58,15.24 v48.58,14.45 v48.58,11.59 51.75,11.59
  Bottom 1.8: 51.75,11.59 51.75,15.72 63.5,15.72 63.5,22.86 68.1,22.86 68.1,36.81 XH2.2
  other vias: 44.13,8.41 44.77,9.05 45.4,9.68 46.04,10.32 46.67,10.95 47.31,11.59 47.94,12.22 49.21,12.22 47.94,10.95 46.67,12.22 47.31,12.86 46.04,12.86 46.04,11.59 45.4,12.22 44.77,12.86 44.13,12.22 44.77,11.59 44.13,10.95 44.77,10.32 45.4,10.95 44.13,9.68 45.4,8.41 46.04,9.05 46.67,8.41 47.31,9.05 46.67,9.68 47.94,8.41 47.94,9.68 47.31,10.32 48.58,10.32 48.58,9.05 49.21,9.68 49.21,8.41 49.21,10.95
  pour Top (isolate 0.406, rank 3, no thermals): 54.77,16.67 37.31,16.67 37.31,7.46 54.77,7.46
  pour Bottom (isolate 0.406, rank 3, no thermals): 38.73,16.67 54.77,16.67 54.77,7.46 38.73,7.46
N$18
  Top 0.61: R17.2 R11.1 44.19,14.13 39.49,14.13 Q5.1
N$19  (via drill 0.35)
  Top 0.61: v47.62,14.45 47.62,15.72 R17.1
  Bottom 0.61: U$3.5 37.78,7.62 37.78,14.45 v47.62,14.45
N$20
  Top 0.61: 27.25,3.65 24.42,3.65 SJ1.1
  Top 1.27: R7.2 27.25,3.65 R6.2
N$21
  Bottom 0.61: JP3.4 18.26,0.95 20.8,0.95 21.59,1.75 21.59,5.4 17.46,9.53 17.46,13.02 IC1.17
N$22
  Bottom 0.61: JP3.1 16.03,8.26 16.03,14.13 IC1.18
N$23  (via drill 0.35)
  Top 0.61: v49.53,14.45 49.53,15.72 R18.2
  Bottom 0.61: U$3.7 35.88,12.7 35.88,16.03 49.53,16.03 v49.53,14.45
N$24
  Top 0.61: 33.81,11.11 C10.1 | U$3.8 31.75,14.61 33.81,14.61 D5.C
  Top 1.27: D5.C 33.81,11.11
N$25
  Top 0.61: 51.56,15.72 Q4.1 | 51.56,15.72 R18.1 | R10.1 51.56,15.88 51.56,15.72
  Top 1.016: 51.59,12.92 Q4.1
N$26  (via drill 1 pad 1.8)
  other vias: 66.04,2.54
N$28  (via drill 1 pad 1.8)
  other vias: 68.58,2.54
N$32
  Top 0.61: R19.2 R13.1 44.19,24.29 39.53,24.29 39.53,23.08 Q13.1
N$34  (via drill 0.35)
  Top 0.61: v47.62,24.61 47.62,25.88 R19.1
  Bottom 0.61: v47.62,24.61 37.78,24.61 37.78,17.78 U$1.5
N$42  (via drill 0.35)
  Top 0.61: v49.53,24.61 49.53,25.88 R20.2
  Bottom 0.61: U$1.7 35.88,22.86 35.88,26.19 49.53,26.19 v49.53,24.61
N$45
  Top 0.61: U$1.8 31.91,24.61 33.81,24.61 D11.C
  Top 1.27: D11.C C11.1
N$46
  Top 0.61: 51.56,26.04 Q6.1 | 51.56,26.04 R20.1 | R12.1 51.56,26.04
N$48  (via drill 0.35)
  Top 0.61: v48.58,34.77 48.58,30.96 Q15.3 43.02,30.96 | U$11.6 32.44,29.15 C12.2 | 54.67,36.04 D20.P$1 | Q14.2 54.45,28.68 54.45,36.04 54.67,36.04 | 54.67,36.04 R9.1
  Top 0.813: D19.P$2 37.94,36.04 37.94,30.96 Q15.3
  Top 1.016: 51.59,28.68 Q14.2 46.79,28.68 Q15.3
  Bottom 0.61: U$11.6 36.83,30.48 36.83,35.56 48.58,35.56 v48.58,34.77 v48.58,31.91 51.75,31.91
  Bottom 1.8: 51.75,31.91 51.75,36.04 63.66,36.04 63.66,40.66 XH3.1
  other vias: 44.13,28.73 44.77,29.37 44.13,30 44.77,30.64 44.13,31.27 44.77,31.91 44.13,32.54 44.77,33.18 45.4,32.54 46.04,33.18 46.67,32.54 47.31,33.18 47.94,32.54 48.58,33.18 49.21,32.54 47.31,31.91 46.04,31.91 45.4,31.27 46.67,31.27 47.94,31.27 49.21,31.27 48.58,30.64 49.21,30 48.58,29.37 47.94,30 47.31,30.64 46.67,30 46.04,30.64 45.4,30 46.04,29.37 45.4,28.73 46.67,28.73 47.31,29.37 47.94,28.73 49.21,28.73
  pour Top (isolate 0.406, rank 3, no thermals): 37.31,36.99 37.31,27.78 54.77,27.78 54.77,36.99
  pour Bottom (isolate 0.406, rank 3, no thermals): 54.77,36.99 54.77,27.78 38.73,27.78 38.73,36.99
N$50
  Top 0.61: R21.2 R8.2 44.19,34.45 39.49,34.45 Q15.1
N$51  (via drill 0.35)
  Top 0.61: v47.62,34.77 47.62,36.04 R21.1
  Bottom 0.61: v47.62,34.77 37.78,34.77 37.78,27.94 U$11.5
N$52  (via drill 0.35)
  Top 0.61: v49.53,34.77 49.53,36.2 R22.2
  Bottom 0.61: U$11.7 35.88,33.02 35.88,36.35 49.53,36.35 v49.53,34.77
N$53
  Top 0.61: U$11.8 32.07,34.61 33.81,34.61 D21.C
  Top 1.27: D21.C C12.1
N$54
  Top 0.61: R9.2 52.55,36.2 51.56,36.2 | 51.56,36.2 R22.1 | Q14.1 51.56,36.2
  Top 1.016: 51.81,33.24 Q14.1
N$56
  Top 0.61: R23.2 R4.2 44.19,44.61 39.49,44.61 Q17.1
N$57  (via drill 0.35)
  Top 0.61: v47.62,44.93 47.62,46.35 R23.1
  Bottom 0.61: U$13.5 37.78,38.1 37.78,44.93 v47.62,44.93
N$58  (via drill 0.35)
  Top 0.61: v49.53,44.93 49.53,46.35 R24.2
  Bottom 0.61: U$13.7 35.88,43.18 35.88,46.51 49.53,46.51 v49.53,44.93
N$59
  Top 0.61: U$13.8 31.91,44.93 33.81,44.93 D24.C
  Top 1.27: D24.C C13.1
N$60
  Top 0.61: Q16.1 51.17,43.4 R24.1 R5.1
PWM_IN0
  Top 0.61: D6.A 8.26,20.64 9.21,21.59 13.49,21.59 16.03,24.13 16.03,33.02 13.49,35.56 IC1.4
  Bottom 0.61: 54.61,49.85 54.61,49.37 14.29,49.37 9.05,44.13 9.05,36.99 10.48,35.56 IC1.4
  pour Bottom (isolate 0.406, rank 2): 28.1,50.64 28.1,49.21 55.4,49.21 56.67,50.48 56.67,50.64
PWM_IN1
  Top 0.61: D3.A 9.04,24.13 13.49,24.13 14.13,24.77 14.13,31.91 13.02,33.02 IC1.5
  Bottom 0.61: 54.61,51.59 54.61,52.23 15.56,52.23 8.1,44.77 8.1,35.88 10.95,33.02 IC1.5
  pour Bottom (isolate 0.406): 28.1,50.96 28.1,52.55 55.24,52.55 56.67,51.12 56.67,50.96
SIGNAL_IN11
  Top 0.61: IC1.25 22.23,33.02 U$11.2
SIGNAL_IN12
  Top 0.61: U$13.2 22.23,41.91 18.26,41.91 17.62,41.27 17.62,40.16 IC1.26
SIGNAL_IN21
  Top 1.27: U$3.2 IC1.16
SIGNAL_IN22
  Top 0.61: IC1.23 21.59,28.57 21.59,24.77 U$1.2
SIGNAL_SD1
  Top 0.61: U$13.3 23.02,40.64 21.59,39.21 21.59,34.96 22.24,34.31 25.72,34.31 25.72,30.48 U$11.3 22.23,30.48 IC1.24
SIGNAL_SD2
  Top 0.61: U$1.3 22.86,20.32 21.59,19.05 21.59,14.45 22.07,13.97 25.08,13.97 25.72,13.34 25.72,10.79 25.08,10.16 U$3.3
  Top 1.27: U$3.3 IC1.15
VCC5
  Top 0.61: U$2.5V

### Text on the board
tNames: RX | TX | + | Motor1 | - | + | Motor2 | - | toArduinoVcc | ATMEGA168 | + | 5-35V | Supply | J1 | - | J2 | PWM | UART | I2C | + | J1 | 0 | 1 | 0 | Supply | J2 | 0 | 0 | 1 | - | L1 | I2C / pullup | L2 | - | + | GND | ardVcc | SDA | SCL
bNames: PWM1 | PWM2 | choosePwmPin&connect | made by / Wooden / Caliper | 2017/11 / ver_1.12